# Altium project Acoustics Board.PrjPcb
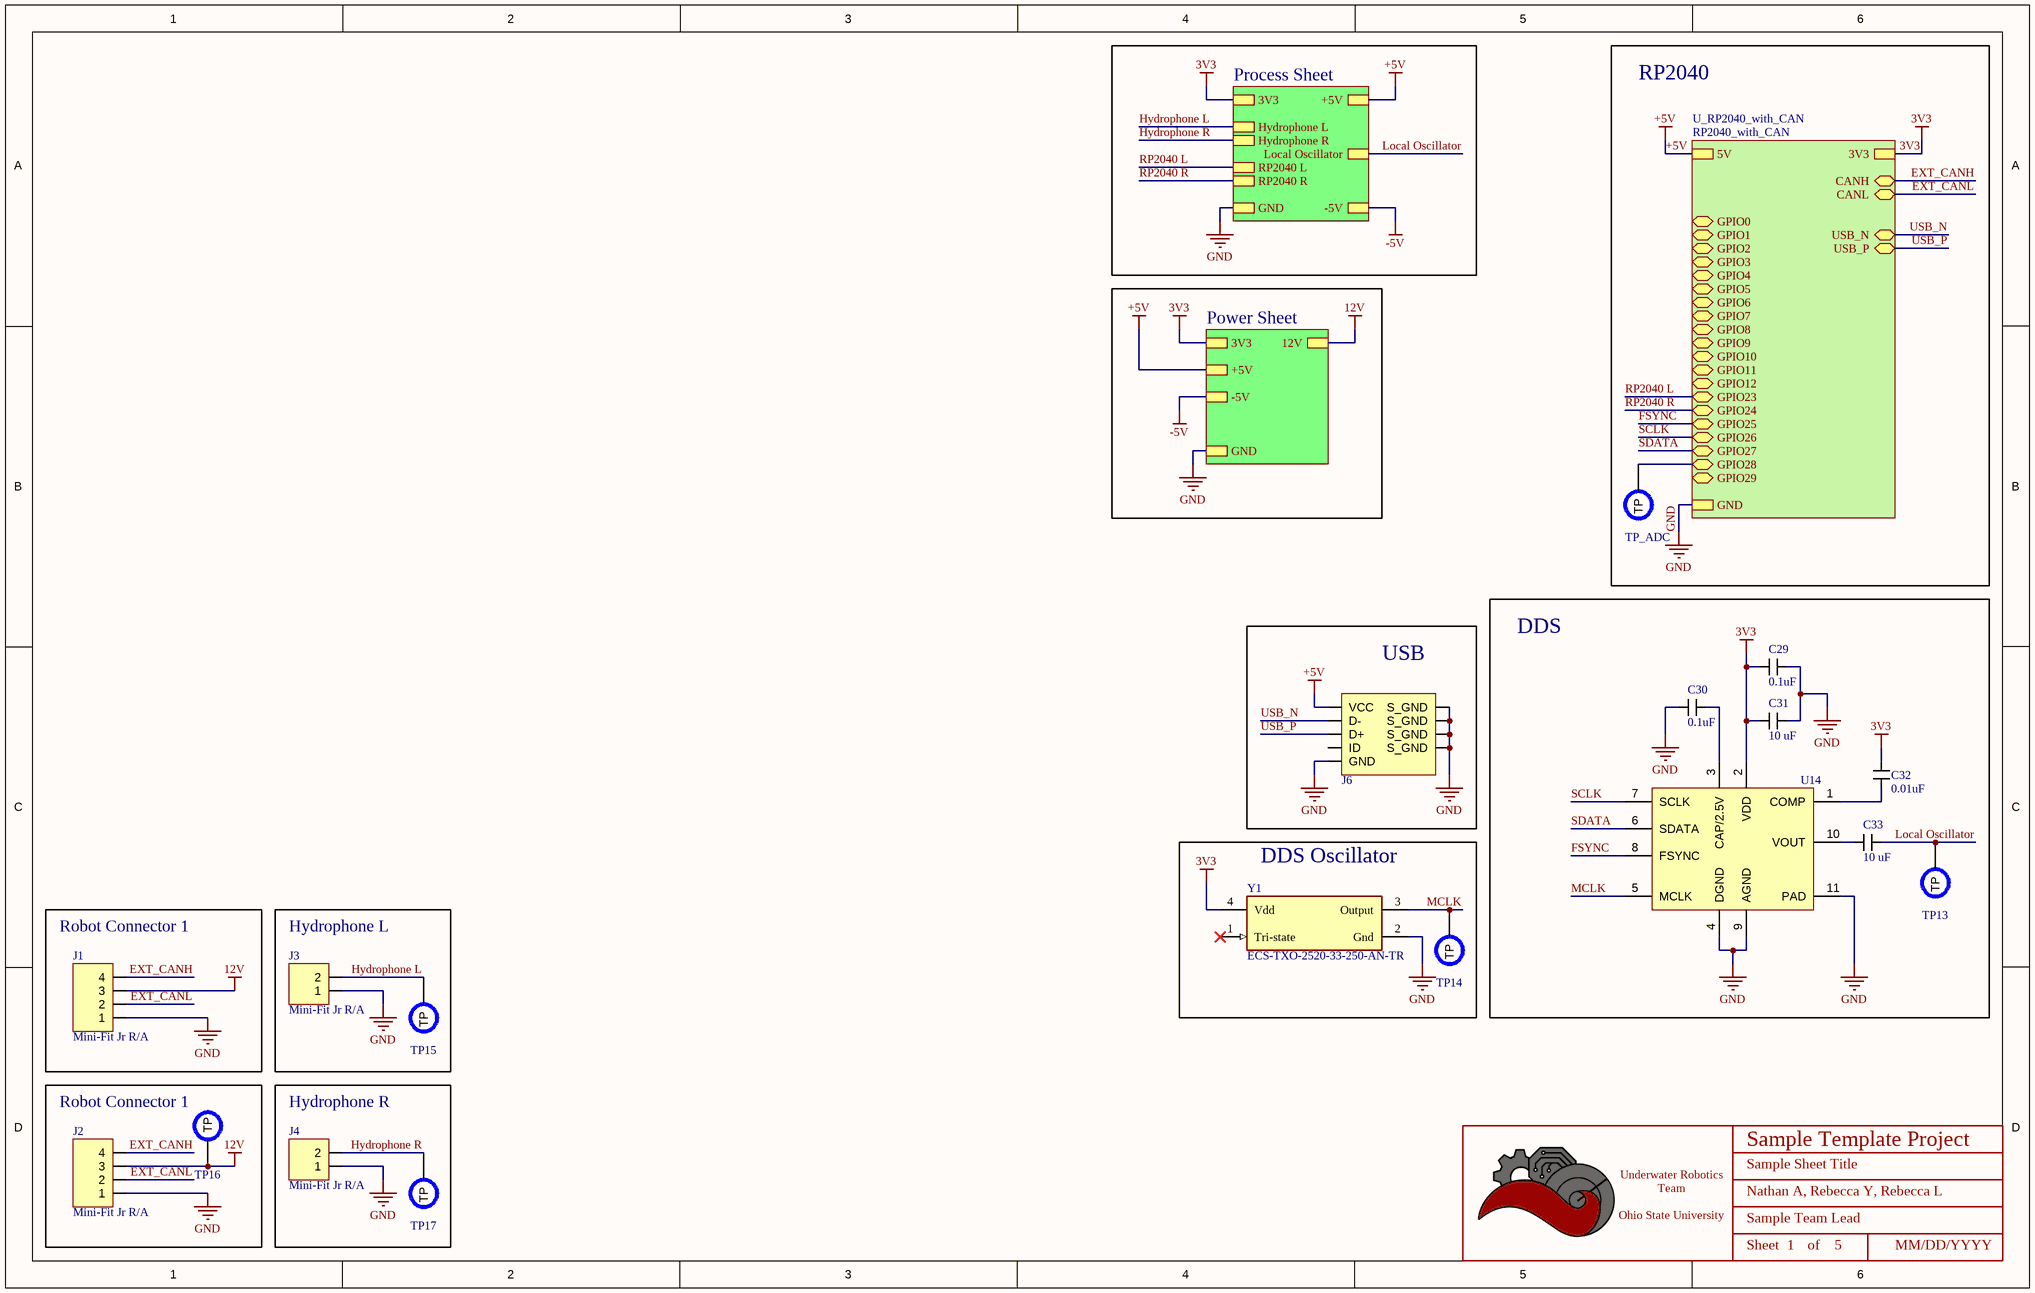
[diagram p0: [Acoustics] Connections & RP2040.SchDoc]
BoardRevision: 1.0; DateOfDesignReview: XX/XX/XXXX; ProjectTitle: Sample Template Project; TeamLead: Sample Team Lead
3 sheets, 72 parts. Net scope: strictly hierarchical (ports join the sheet entries above them; power ports are local).
Board file: Acoustics Board.PcbDoc
Sheets:
  [Acoustics] Connections & RP2040.SchDoc
    Process Sheet = [Acoustics] Hydrophone Process.SchDoc
    Power Sheet = [Acoustics] Power.SchDoc

## Sheet [Acoustics] Connections & RP2040.SchDoc: Sample Sheet Title
size B; Date: MM/DD/YYYY; Author: Nathan A, Rebecca Y, Rebecca L; Organization: ORGANIZATION; Address1: ADDRESS 1; Address2: ADDRESS 2; Address3: ADDRESS 3; Address4: ADDRESS 4; Revision: -; SheetNumber: 1; SheetTotal: 5; ENG_APP_DATE: --/--/--; DSN_APP_DATE: --/--/--; CHK_APP_DATE: --/--/--

### Parts
(Parts that share a designator on the sheet are numbered #1, #2 ... from top to bottom, then left to right.)
*#1  Title_Block  [LOGO]  (value not drawn)  (graphical)
C29  value 0.1uF  [CAPACITOR_0603]  (hidden comment: 100nF Ceramic 6.3V)
C30  value 0.1uF  [CAPACITOR_0603]  (hidden comment: 100nF Ceramic 6.3V)
C31  Value (uF): 10 uF  [CAPACITOR_0603]  (hidden comment: 10uF Ceramic 6.3V)
C32  value 0.01uF  [CAPACITOR_0603]  (hidden comment: CL10B103KB8NNNC)
C33  Value (uF): 10 uF  [CAPACITOR_0603]  (hidden comment: 10uF Ceramic 6.3V)
J1  Mini-Fit Jr R/A  [CONN_MOLEX_MINIFIT JR_4 POS_R/A]
J2  Mini-Fit Jr R/A  [CONN_MOLEX_MINIFIT JR_4 POS_R/A]
J3  Mini-Fit Jr R/A  [CONN_MOLEX_MINIFIT JR_2 POS_R/A]
J4  Mini-Fit Jr R/A  [CONN_MOLEX_MINIFIT JR_2 POS_R/A]
J6  USB_MICRO R/A  [CONN_MINIUSB]  (value not drawn)
TP13  PCB Test Point  [TESTPOINT_1.2MM]  (value not drawn)  (no BOM)
TP14  PCB Test Point  [TESTPOINT_1.2MM]  (value not drawn)  (no BOM)
TP15  PCB Test Point  [TESTPOINT_1.2MM]  (value not drawn)  (no BOM)
TP16  PCB Test Point  [TESTPOINT_1.2MM]  (value not drawn)  (no BOM)
TP17  PCB Test Point  [TESTPOINT_1.2MM]  (value not drawn)  (no BOM)
TP_ADC  PCB Test Point  [TESTPOINT_1.2MM]  (value not drawn)  (no BOM)
U14  IC DDS 5MHZ 10BIT 10LFCSP  [CP-10-9]  (value not drawn)
Y1  ECS-TXO-2520-33-250-AN-TR  [FP-ECS-TXO-2520-MFG]

### Blocks framed on the sheet
RP2040: TP_ADC
DDS: C29-C33 TP13 U14
USB: J6
DDS Oscillator: TP14 Y1
Robot Connector 1: J1
Hydrophone L: J3 TP15
Robot Connector 1: J2 TP16
Hydrophone R: J4 TP17

### Sub-sheets
Power Sheet = [Acoustics] Power.SchDoc: 3V3, 12V, -5V, GND, +5V
Process Sheet = [Acoustics] Hydrophone Process.SchDoc: Hydrophone L, Hydrophone R, RP2040 L, RP2040 R, 3V3, +5V, -5V, GND, Local Oscillator
U_RP2040_with_CAN = RP2040_with_CAN (file not in this document): USB_P (bidir), USB_N (bidir), 5V, CANH (bidir), CANL (bidir), GPIO0 (bidir), GPIO1 (bidir), GPIO2 (bidir), GPIO3 (bidir), GPIO4 (bidir), GPIO5 (bidir), GPIO6 (bidir), GPIO7 (bidir), GPIO8 (bidir), GPIO9 (bidir), GPIO10 (bidir), GPIO11 (bidir), GPIO12 (bidir), GPIO23 (bidir), GPIO24 (bidir), GPIO25 (bidir), GPIO26 (bidir), GPIO27 (bidir), GPIO28 (bidir), GPIO29 (bidir), 3V3, GND

### Nets
3V3: C29.2 C31.1 C32.1 U14.2(VDD) Y1.4(Vdd) ; sheet U_RP2040_with_CAN/3V3, sheet Process Sheet/3V3, sheet Power Sheet/3V3
12V: J1.3 J2.3 TP16.TP ; sheet Power Sheet/12V
+5V: J6.1(VCC) ; sheet U_RP2040_with_CAN/5V, sheet Process Sheet/+5V, sheet Power Sheet/+5V
-5V: sheet Process Sheet/-5V, sheet Power Sheet/-5V
GND: C29.1 C30.1 C31.2 J1.1 J2.1 J3.1 J4.1 J6.5(GND) J6.6(S_GND) J6.7(S_GND) J6.8(S_GND) J6.9(S_GND) U14.4(DGND) U14.9(AGND) U14.11(PAD) Y1.2(Gnd) ; sheet U_RP2040_with_CAN/GND, sheet Process Sheet/GND, sheet Power Sheet/GND
EXT_CANH: J1.4 J2.4 ; sheet U_RP2040_with_CAN/CANH
EXT_CANL: J1.2 J2.2 ; sheet U_RP2040_with_CAN/CANL
FSYNC: U14.8(FSYNC) ; sheet U_RP2040_with_CAN/GPIO25
Hydrophone L: J3.2 TP15.TP ; sheet Process Sheet/Hydrophone L
Hydrophone R: J4.2 TP17.TP ; sheet Process Sheet/Hydrophone R
Local Oscillator: C33.2 TP13.TP ; sheet Process Sheet/Local Oscillator
MCLK: TP14.TP U14.5(MCLK) Y1.3(Output)
RP2040 L: sheet U_RP2040_with_CAN/GPIO23, sheet Process Sheet/RP2040 L
RP2040 R: sheet U_RP2040_with_CAN/GPIO24, sheet Process Sheet/RP2040 R
SCLK: U14.7(SCLK) ; sheet U_RP2040_with_CAN/GPIO26
SDATA: U14.6(SDATA) ; sheet U_RP2040_with_CAN/GPIO27
USB_N: J6.2(D-) ; sheet U_RP2040_with_CAN/USB_N
USB_P: J6.3(D+) ; sheet U_RP2040_with_CAN/USB_P
NetC30_2: C30.2 U14.3(CAP/2.5V)
NetC32_2: C32.2 U14.1(COMP)
NetC33_1: C33.1 U14.10(VOUT)
NetTP_ADC_TP: TP_ADC.TP ; sheet U_RP2040_with_CAN/GPIO28

Not connected (* = marked no-connect by the designer): J6 4(ID); Y1 1(Tri-state)*

### Notes on the sheet
- DWG. NO.
- REV.
- SHT.
- THIS DOCUMENT AND THE DATA DISCLOSED HEREIN OR HEREWITH IS THE PROPERTY OF ALTIUM LIMITED AND MAY BE FREELY DISTRIBUTED IN WHOLE. NO RIGHTS ARE RESERVED OR EXPRESS OR IMPLIED WARANTEE GIVEN.
- REVISION
- DESCRIPTION
- DATE
- APPROVED
- ENG:
- APPROVALS
- PROJECT
- DSN:
- CHK:
- REFERENCE DOCUMENTS
- PROJECT REVISION:
- TITLE
- DOCUMENT REVISION:
- DESIGN ITEM:
- BOM:
- FAB DWG:
- PCB DWG:
- ASSY DWG:
- SCALE:
- SIZE
- B
- CAGE CODE
- FILE NAME
- DWG NO.
- SHEET
- OF
- REV
- (in symbol Title_Block) Underwater Robotics Team / Ohio State University; Sheet; of

### Library data of the parts
*#1 = Title_Block: UWRT Schematic Title Block Template / Created June 2021, Dylan Trainor
C29 C30 = CAPACITOR_0.1uF_0603: Cap 100nF 6.3V +/-10% / Ceramic 0603; Made By: Flip B; ComponentLink1Description: Datsheet; ComponentLink1URL: https://www.mouser.com/datasheet/2/212/KEM_C1002_X7R_SMD-1102033.pdf; Tolerance: +/- 10%; Voltage: 6.3V; Supplier 1: Digi-Key; Supplier Part Number 1: 399-15351-1-ND
C31 C33 = CAPACITOR_10uF_0603: Cap 10uF 6.3V +/-20% / Ceramic 0603; Made By: Flip B; ComponentLink1Description: Digikey; ComponentLink1URL: https://www.digikey.com/en/products/detail/samsung-electro-mechanics/CL10A106MQ8NNNC/3886777; Supplier 1: Digi-Key; Supplier Part Number 1: 1276-1119-1-ND; Tolerance: +/- 20%; Voltage: 6.3V
C32 = CAPACITOR_0.01uF_0603_50V: 10000 pF ±10% 50V Ceramic Capacitor X7R 0603 (1608 Metric); Tolerance: +/- 10%; Voltage: 6.3V; Made By: Flip B; ComponentLink1Description: Datsheet; ComponentLink1URL: https://www.mouser.com/datasheet/2/212/KEM_C1002_X7R_SMD-1102033.pdf; Supplier 1: Arrow Electronics; Supplier Part Number 1: CL10B103KB8NNNC
J1 J2 = CONN_MOLEX_MINIFIT JR_4POS_R/A: Molex Minifit Jr. 5569 / 4 Pos R/A Natural; Pitch: 4.2mm; Configuration: Right Angle; Current Per Pin: 13A; Number of Positions: 4; Supplier Part Number 1: WM13112-ND; Supplier 1: Digi-Key; Manufacturer: Molex; Color: Natural; Created By: Flip B; ComponentLink1Description: Datasheet; ComponentLink1URL: https://www.molex.com/pdm_docs/sd/026013115_sd.pdf; Series: Minifit Jr 5569
J3 J4 = CONN_MOLEX_MINIFIT JR_2POS_R/A: Molex Minifit Jr. 5569 / 2 Pos R/A Natural; Pitch: 4.2mm; Configuration: Right Angle; Current Per Pin: 13A; Number of Positions: 2; Manufacturer: Molex; Color: Natural; Created By: Robert P; ComponentLink1Description: Datasheet; ComponentLink1URL: https://www.molex.com/pdm_docs/sd/026013115_sd.pdf; Series: Minifit Jr 5569; Supplier 1: Digi-Key; Supplier Part Number 1: WM1351-ND
J6 = CONN_MICROUSB: Amphenol Micro USB-B / USB2.0 5 Pin Right Angle SMD; Pitch: 0.65mm; Current Per Pin: 1.8A; Number of Positions: 5; Manufacturer: Amphenol; Configuration: Right Angle; Color: Silver; Created By: Flip B; ComponentLink1Description: Datasheet; ComponentLink1URL: https://cdn.amphenol-icc.com/media/wysiwyg/files/documentation/datasheet/inputoutput/io_usb_micro.pdf?__cf_chl_jschl_tk__=05693735e19256298f6ef6ca2bb2e65c376a4f56-1625503833-0-Abitsb0-ufjOXJYs_S3J3r2iTn-nObalbmXUksF1VvO_h_WEmRdMlUD1I8-hmWSEVWzY1pirKnrPZWfgY3851qyBZe5ZvnNQePLGIzUgdEIQBVUyW36RsbYpDLEWxJ4horD-5gChFgobLYqwmG5aHl0E8lIn_twwPPrOxilK2gP0q9t_CNOs_u5fMqXvXUrlsOv8tIE2NRlu6NVP8qtkL2GjhlkeTUbDMF8WvvpPDTFOgvZ4Y16Ej8F8AhWos88mo5B1HssXozw0XrkJQIqERITUu6rqloz9kf4ZzhBHtDAt-IkiAFY_Ds9SW8FYKKTtINJVpHZQ6Gyu1FFM4Dc9MO0maE8_mmNcwlxqyRoRk_MPWW8VyByXWM5RSp52jteRKw7FeI9WIYvCbPAOy0Eyib-aseIQsnGbglBcUY6_2xp8GYaJM38H3dNvBPsSOfJBPndKedwKHllxjkucXn6xsN0sDXkpGN-cu8_2bDTJ0g-uUucKSCooYX-ApSDNGpkA_p9zv1SOAD8c0zaZVmtiBsN75QpVz2rzq9_BFxOywPvR; Series: 10118192; Supplier 1: Digi-Key; Supplier Part Number 1: 609-4613-1-ND
TP13-TP17 TP_ADC = TESTPOINT: Made By: Robert Pafford
U14 = AD9837ACPZ: Direct Digital Synthesis IC 10 b 5 MHz 28 b Tuning 10-LFCSP-WD (3x3)
Y1 = CMP-40224-000034-1: XTAL OSC TCXO 25.0000MHZ HCMOS; RoHS Compliant: Yes

## Sheet [Acoustics] Hydrophone Process.SchDoc: Sample Sheet Title
size B; Date: 10/22/2023; Author: Nathan A, Rebecca Y, Rebecca L; Organization: ORGANIZATION; Address1: ADDRESS 1; Address2: ADDRESS 2; Address3: ADDRESS 3; Address4: ADDRESS 4; Revision: -; SheetNumber: 2; SheetTotal: 5; ENG_APP_DATE: --/--/--; DSN_APP_DATE: --/--/--; CHK_APP_DATE: --/--/--
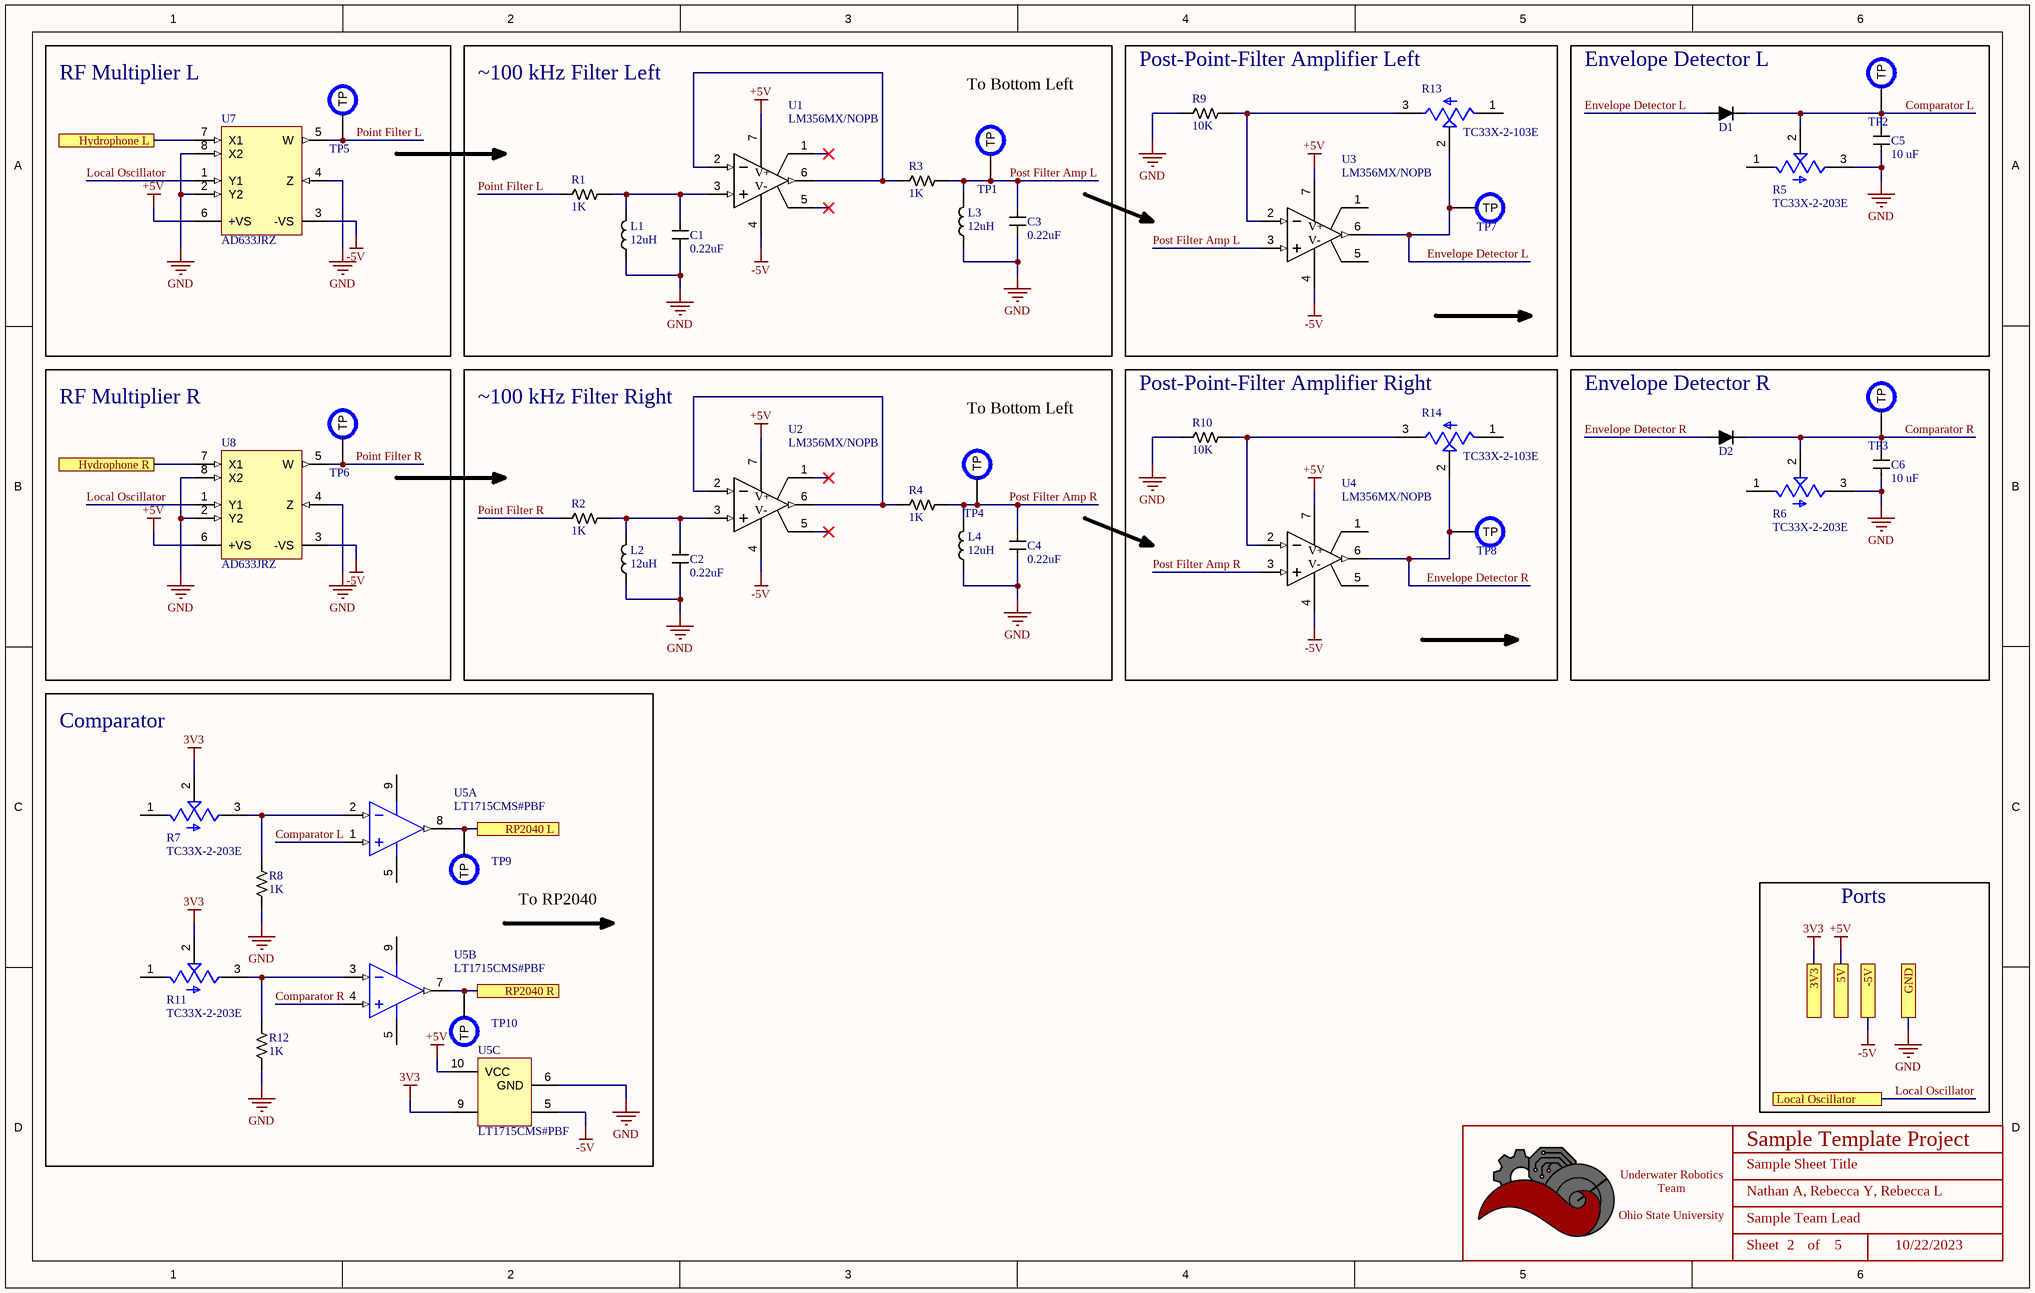
[diagram p1: [Acoustics] Hydrophone Process.SchDoc]

### Parts
(Parts that share a designator on the sheet are numbered #1, #2 ... from top to bottom, then left to right.)
*#2  Title_Block  [LOGO]  (value not drawn)  (graphical)
C1  value 0.22uF  [CAPACITOR_0603]  (hidden comment: 0.22uF Ceramic 16V)
C2  value 0.22uF  [CAPACITOR_0603]  (hidden comment: 0.22uF Ceramic 16V)
C3  value 0.22uF  [CAPACITOR_0603]  (hidden comment: 0.22uF Ceramic 16V)
C4  value 0.22uF  [CAPACITOR_0603]  (hidden comment: 0.22uF Ceramic 16V)
C5  Value (uF): 10 uF  [CAPACITOR_0603]  (hidden comment: 10uF Ceramic 6.3V)
C6  Value (uF): 10 uF  [CAPACITOR_0603]  (hidden comment: 10uF Ceramic 6.3V)
D1  BAR9002ELE6327XTMA1  [DIODE_0402]  (value not drawn)
D2  BAR9002ELE6327XTMA1  [DIODE_0402]  (value not drawn)
L1  value 12uH  [INDUCTOR_0603]  (hidden comment: FIXED IND 12UH 10MA 1.8 OHM SMD)
L2  value 12uH  [INDUCTOR_0603]  (hidden comment: FIXED IND 12UH 10MA 1.8 OHM SMD)
L3  value 12uH  [INDUCTOR_0603]  (hidden comment: FIXED IND 12UH 10MA 1.8 OHM SMD)
L4  value 12uH  [INDUCTOR_0603]  (hidden comment: FIXED IND 12UH 10MA 1.8 OHM SMD)
R1  Value  (Ohms): 1K  [RESISTOR_0603]  (hidden comment: 1.45k Ohm 0.1% 1/10W)
R2  Value  (Ohms): 1K  [RESISTOR_0603]  (hidden comment: 1.45k Ohm 0.1% 1/10W)
R3  Value  (Ohms): 1K  [RESISTOR_0603]  (hidden comment: 1.45k Ohm 0.1% 1/10W)
R4  Value  (Ohms): 1K  [RESISTOR_0603]  (hidden comment: 1.45k Ohm 0.1% 1/10W)
R5  TC33X-2-203E  [TRIM_TC33X-2-203E]
R6  TC33X-2-203E  [TRIM_TC33X-2-203E]
R7  TC33X-2-203E  [TRIM_TC33X-2-203E]
R8  Value  (Ohms): 1K  [RESISTOR_0402]  (hidden comment: 1k Ohm 1% 1/16W)
R9  Value  (Ohms): 10K  [RESISTOR_0603]  (hidden comment: 10k Ohm 0.5% 1/10W)
R10  Value  (Ohms): 10K  [RESISTOR_0603]  (hidden comment: 10k Ohm 0.5% 1/10W)
R11  TC33X-2-203E  [TRIM_TC33X-2-203E]
R12  Value  (Ohms): 1K  [RESISTOR_0402]  (hidden comment: 1k Ohm 1% 1/16W)
R13  TC33X-2-103E  [TRIM_TC33X-2-203E]
R14  TC33X-2-103E  [TRIM_TC33X-2-203E]
TP1  PCB Test Point  [TESTPOINT_1.2MM]  (value not drawn)  (no BOM)
TP2  PCB Test Point  [TESTPOINT_1.2MM]  (value not drawn)  (no BOM)
TP3  PCB Test Point  [TESTPOINT_1.2MM]  (value not drawn)  (no BOM)
TP4  PCB Test Point  [TESTPOINT_1.2MM]  (value not drawn)  (no BOM)
TP5  PCB Test Point  [TESTPOINT_1.2MM]  (value not drawn)  (no BOM)
TP6  PCB Test Point  [TESTPOINT_1.2MM]  (value not drawn)  (no BOM)
TP7  PCB Test Point  [TESTPOINT_1.2MM]  (value not drawn)  (no BOM)
TP8  PCB Test Point  [TESTPOINT_1.2MM]  (value not drawn)  (no BOM)
TP9  PCB Test Point  [TESTPOINT_1.2MM]  (value not drawn)  (no BOM)
TP10  PCB Test Point  [TESTPOINT_1.2MM]  (value not drawn)  (no BOM)
U1  LM356MX/NOPB  [SOIC-8]
U2  LM356MX/NOPB  [SOIC-8]
U3  LM356MX/NOPB  [SOIC-8]
U4  LM356MX/NOPB  [SOIC-8]
U5  LT1715CMS#PBF  [LT-MS10_N]  (parts A,B,C of 3)
U7  AD633JRZ  [ADI-R-8_M]
U8  AD633JRZ  [ADI-R-8_M]

### Blocks framed on the sheet
RF Multiplier L: TP5 U7
~100 kHz Filter Left: C1 C3 L1 L3 R1 R3 TP1 U1
Post-Point-Filter Amplifier Left: R9 R13 TP7 U3
Envelope Detector L: C5 D1 R5 TP2
RF Multiplier R: TP6 U8
~100 kHz Filter Right: C2 C4 L2 L4 R2 R4 TP4 U2
Post-Point-Filter Amplifier Right: R10 R14 TP8 U4
Envelope Detector R: C6 D2 R6 TP3
Comparator: R7 R8 R11 R12 TP9 TP10 U5

### Ports
3V3, 5V, -5V, GND, Hydrophone L, Hydrophone R, Local Oscillator, RP2040 L, RP2040 R

### Nets
3V3: R7.2(W) R11.2(W) U5.9(+VS) ; port 3V3
+5V: U1.7(V+) U2.7(V+) U3.7(V+) U4.7(V+) U5.10(VCC) U7.6(+VS) U8.6(+VS) ; port 5V
-5V: U1.4(V-) U2.4(V-) U3.4(V-) U4.4(V-) U5.5(VEE) U7.3(-VS) U8.3(-VS) ; port -5V
GND: C1.2 C2.2 C3.2 C4.2 C5.2 C6.2 L1.2 L2.2 L3.2 L4.2 R5.3(CW) R6.3(CW) R8.2 R9.2 R10.2 R12.2 U5.6(GND) U7.2(Y2) U7.4(Z) U7.8(X2) U8.2(Y2) U8.4(Z) U8.8(X2) ; port GND
Comparator L: C5.1 D1.2 R5.2(W) TP2.TP U5.1(+IN_A)
Comparator R: C6.1 D2.2 R6.2(W) TP3.TP U5.4(+IN_B)
Envelope Detector L: D1.1 R13.2(W) TP7.TP U3.6(OUT)
Envelope Detector R: D2.1 R14.2(W) TP8.TP U4.6(OUT)
Hydrophone L: U7.7(X1) ; port Hydrophone L
Hydrophone R: U8.7(X1) ; port Hydrophone R
Local Oscillator: U7.1(Y1) U8.1(Y1) ; port Local Oscillator
Point Filter L: R1.2 TP5.TP U7.5(W)
Point Filter R: R2.2 TP6.TP U8.5(W)
Post Filter Amp L: C3.1 L3.1 R3.1 TP1.TP U3.3(IN+)
Post Filter Amp R: C4.1 L4.1 R4.1 TP4.TP U4.3(IN+)
RP2040 L: TP9.TP U5.8(OUT_A) ; port RP2040 L
RP2040 R: TP10.TP U5.7(OUT_B) ; port RP2040 R
NetC1_1: C1.1 L1.1 R1.1 U1.3(IN+)
NetC2_1: C2.1 L2.1 R2.1 U2.3(IN+)
NetR3_2: R3.2 U1.2(IN-) U1.6(OUT)
NetR4_2: R4.2 U2.2(IN-) U2.6(OUT)
NetR7_3: R7.3(CW) R8.1 U5.2(-IN_A)
NetR9_1: R9.1 R13.3(CW) U3.2(IN-)
NetR10_1: R10.1 R14.3(CW) U4.2(IN-)
NetR11_3: R11.3(CW) R12.1 U5.3(-IN_B)

Not connected (* = marked no-connect by the designer): R5 1(CCW); R6 1(CCW); R7 1(CCW); R11 1(CCW); R13 1(CCW); R14 1(CCW); U1 1(Balance)* 5(Balance)*; U2 1(Balance)* 5(Balance)*; U3 1(Balance) 5(Balance); U4 1(Balance) 5(Balance)

### Notes on the sheet
- To Bottom Left
- To RP2040
- Ports
- DWG. NO.
- REV.
- SHT.
- THIS DOCUMENT AND THE DATA DISCLOSED HEREIN OR HEREWITH IS THE PROPERTY OF ALTIUM LIMITED AND MAY BE FREELY DISTRIBUTED IN WHOLE. NO RIGHTS ARE RESERVED OR EXPRESS OR IMPLIED WARANTEE GIVEN.
- REVISION
- DESCRIPTION
- DATE
- APPROVED
- ENG:
- APPROVALS
- PROJECT
- DSN:
- CHK:
- REFERENCE DOCUMENTS
- PROJECT REVISION:
- TITLE
- DOCUMENT REVISION:
- DESIGN ITEM:
- BOM:
- FAB DWG:
- PCB DWG:
- ASSY DWG:
- SCALE:
- SIZE
- B
- CAGE CODE
- FILE NAME
- DWG NO.
- SHEET
- OF
- REV
- (in symbol Title_Block) Underwater Robotics Team / Ohio State University; Sheet; of

### Library data of the parts
*#2 = Title_Block: as *#1 on sheet [Acoustics] Connections & RP2040
C1-C4 = CAPACITOR_0.000027uF_0603: CAP CER 0.22uF 16V X7R 0603; Tolerance: +/- 5%; Made By: Nathan Ayer; Voltage: 16V; ComponentLink2Description: Digikey; ComponentLink2URL: https://www.digikey.com/en/products/detail/yageo/CC0603JRX7R7BB224/5883645
C5 C6 = CAPACITOR_10uF_0603: as C31 on sheet [Acoustics] Connections & RP2040; ComponentLink1Description: Digikey; ComponentLink1URL: https://www.digikey.com/en/products/detail/samsung-electro-mechanics/CL10A106MQ8NNNC/3886777; Supplier 1: Digi-Key; Supplier Part Number 1: 1276-1119-1-ND; Tolerance: +/- 20%; Voltage: 6.3V
D1 D2 = RF Diode 80V 100mA: RF Diode PIN - Single 80V 100 mA 250 mW PG-TSLP-2-19; Forward Current: 100mA; Voltage - Peak Reverse: 80V; Package: 0402
L1-L4 = INDUCTOR_12uH_0603: 12 µH Shielded Multilayer Inductor 10 mA 1.8Ohm Max 0603 (1608 Metric); Tolerance: +/- 5%; Made By: Nathan Ayer; DC Resistance: 1.8Ohm; Current Rating: 10mA; ComponentLink1Description: Digikey; ComponentLink1URL: https://www.digikey.com/en/products/detail/tdk-corporation/MLF1608E120JTD25/4743066
R1-R4 = RESISTOR_1K_0603: RES 1.45K OHM 0.1% 1/10W 0603; Tolerance: +/- 0.1%; Made By: Nathan Ayer; ComponentLink1Description: Digikey; ComponentLink1URL: https://www.digikey.com/en/products/detail/koa-speer-electronics-inc/RN73H1JTTD1451B50/10688964; Wattage: 1/10W; Supplier: Digikey; Digikey Part Numer: CR0603-JW-104ELFTR-ND
R5-R7 R11 R13 R14 = TC33X-2-203E: 20 kOhms 0.1W, 1/10W J Lead Surface Mount Trimmer Potentiometer Cermet 1 Turn Top Adjustment; MF: Bourns; Value: *; SnapEDA_Link: https://www.snapeda.com/parts/TC33X-2-203E/Bourns/view-part/312812/?ref=snap; Check_prices: https://www.snapeda.com/parts/TC33X-2-203E/Bourns/view-part/312812/?ref=eda; Digi-Key_Part_Number: TC33X-2-203ECT-ND; Purchase-URL: https://pricing.snapeda.com/search/part/TC33X-2-203E/?ref=eda; Package: 1608 Bourns; MP: TC33X-2-203E
  R7 R11: Supplier 1: Mouser; Supplier Part Number 1: 652-TC33X-2-203E
R8 R12 = RESISTOR_1K_0402: RES 1k OHM 1% 1/16W 0402; Tolerance: +/- 1%; Made By: Robert Pafford; Wattage: 1/16W; Supplier: Digikey; Digikey Part Numer: CR0603-JW-104ELFTR-ND; Supplier 1: Digi-Key; Supplier Part Number 1: 13-AC0402FR-131KLCT-ND
R9 R10 = RESISTOR_10K_0.5%_0603: RES 10k OHM 0.5% 1/10W 0603; Tolerance: +/- 0.5%; Made By: Robert Pafford; Wattage: 1/10W; Supplier: Digikey; Digikey Part Numer: CR0603-JW-104ELFTR-ND; Supplier 1: Digi-Key; Supplier Part Number 1: 749-1695-1-ND
TP1-TP10 = TESTPOINT: Made By: Robert Pafford
U1-U4 = LM356MX/NOPB: IC OPAMP JFET 1 CIRCUIT 8SOIC; PartNumber: LM8261M5X/NOPB; Manufacturer: Texas Instruments; Supply Current: 1.3 mA; Supply Voltage: 2.5 V ~ 30 V, +/- 1.25 V ~ 15 V; Gain Bandwidth Product: 21 MHz; Created By: Dylan T; ComponentLink1Description: Digi-Key; ComponentLink1URL: https://www.digikey.com/en/products/detail/texas-instruments/LF356MX-NOPB/366701
U5 = CMP-0360-00164-2: 4 ns, 150 MHz Comparator with Independent Input / Output Supplies, 2 Channels, 2.7 to 12 V, 0 to +70 degC, 10-pin MSOP (MS10); Generic Part Number: LT1715; Manufacturer: Linear Technology; Prop Delay (us): 0.004; Vos (mV) Typical: 0.4; Channels (#): 2; Vs Min (V): 2.7; Supply Current (uA) Typical: 7500; Vos (mV) Guaranteed: 2.5; Vs Max (V): 12; Supply Voltage Range: 2.7 to 12 V; ComponentLink1Description: Manufacturer URL; ComponentLink1URL: http://www.linear.com/; RoHS: Y; ComponentLink2URL: http://cds.linear.com/docs/en/datasheet/1715fa.pdf; Features: Comparator, Separate In/Out Power Supply; Mounting Technology: Surface Mount; ComponentLink3URL: http://cds.linear.com/docs/en/packaging/MSOP_10_05-08-1661.pdf; ComponentLink3Description: Package Specification; PartNumber: LT1715CMS#PBF; PackageReference: MS10; ComponentLink2Description: Datasheet; PackageDescription: 10-Pin MSOP, Body 3 x 3 mm, Pitch 0.5 mm; DatasheetVersion: Rev A
U7 U8 = CMP-1592-00007-1: Low Cost Analog Multiplier, 20 V/us, 6 mA, 0 to 70 degC, 8-Pin SOIC (R), RoHS, Tube; PartNumber: AD633; Supply Current Max: 6 mA; Slew Rate: 20 V/us; Number of Channels: 2; DatasheetVersion: Rev. K; PackageDescription: 8-Pin Small Outline Package, Body 4.9 x 3.9 mm, Pitch 1.27 mm; PackageVersion: 06/2006; ComponentLink3Description: Package Specification; ComponentLink2Description: Datasheet; RoHS: TRUE; Mounting Technology: Surface Mount; ComponentLink1Description: Manufacturer URL; Packing: Tube; Code_JEDEC: MS-012-AA; ComponentLink1URL: http://www.analog.com/en/index.html; Temperature Max: 70 degC; Temperature Min: 0 degC; ComponentLink3URL: http://www.analog.com/media/en/package-pcb-resources/package/pkg_pdf/soic_narrow-r/r_8.pdf; ComponentLink2URL: http://www.analog.com/media/en/technical-documentation/data-sheets/AD633.pdf

## Sheet [Acoustics] Power.SchDoc: Sample Sheet Title
size B; Date: MM/DD/YYYY; Author: Nathan A, Rebecca Y, Rebecca L; Organization: ORGANIZATION; Address1: ADDRESS 1; Address2: ADDRESS 2; Address3: ADDRESS 3; Address4: ADDRESS 4; Revision: -; SheetNumber: 3; SheetTotal: 5; ENG_APP_DATE: --/--/--; DSN_APP_DATE: --/--/--; CHK_APP_DATE: --/--/--
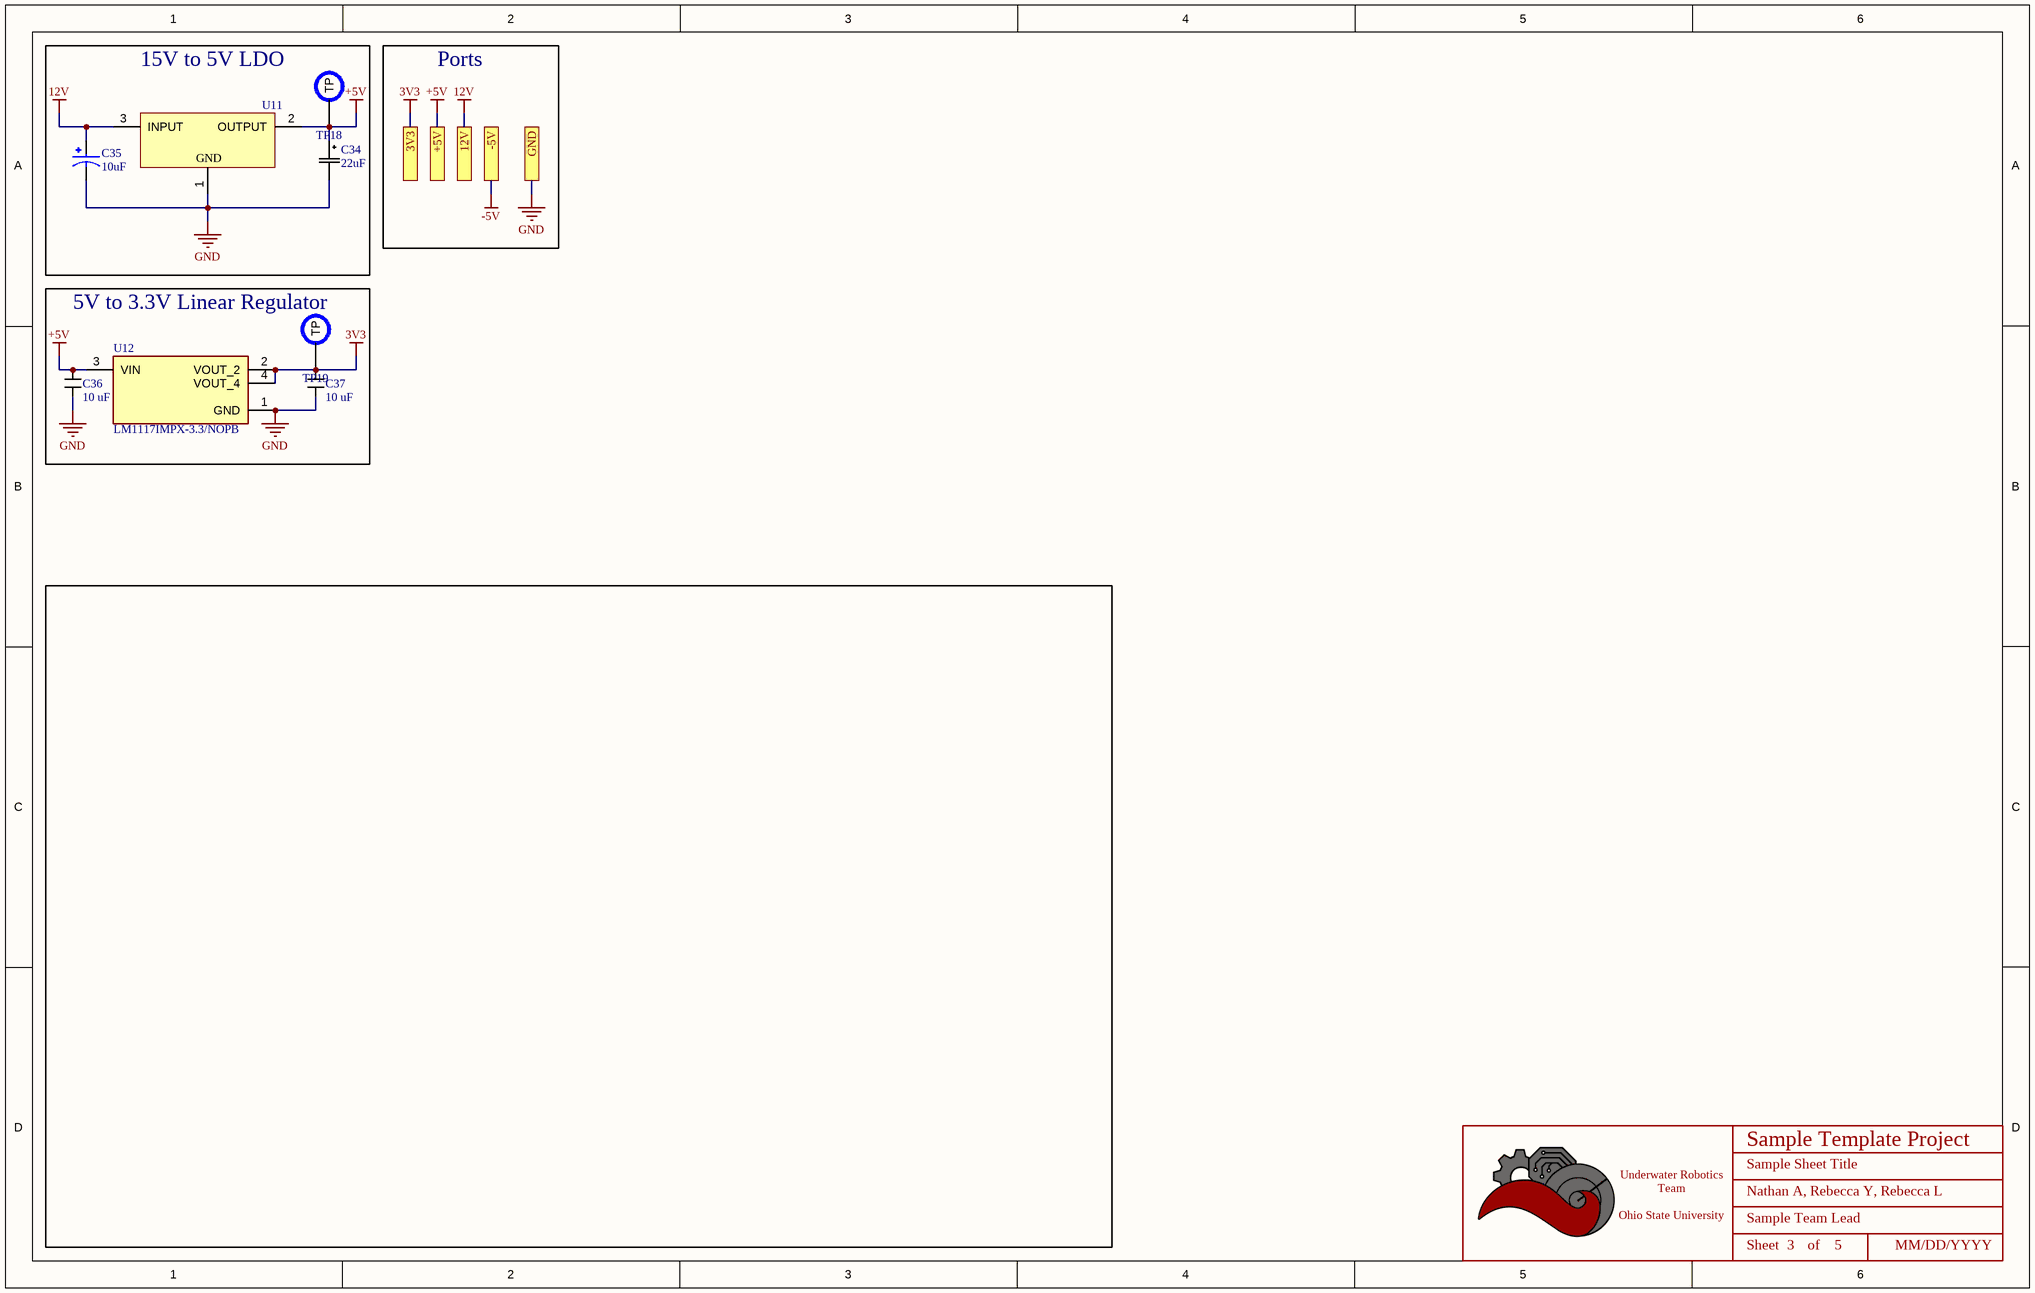
[diagram p2: [Acoustics] Power.SchDoc]

### Parts
(Parts that share a designator on the sheet are numbered #1, #2 ... from top to bottom, then left to right.)
*#3  Title_Block  [LOGO]  (value not drawn)  (graphical)
C34  value 22uF  [PCAP_8x5.4-ELECT_NCA]  (hidden comment: 22uF electrolytic 35 V)
C35  value 10uF  [CAP_EEHZC1J100P]  (hidden comment: 10uF electrolytic 63V)
C36  Value (uF): 10 uF  [CAPACITOR_0603]  (hidden comment: 10uF Ceramic 6.3V)
C37  Value (uF): 10 uF  [CAPACITOR_0603]  (hidden comment: 10uF Ceramic 6.3V)
TP18  PCB Test Point  [TESTPOINT_1.2MM]  (value not drawn)  (no BOM)
TP19  PCB Test Point  [TESTPOINT_1.2MM]  (value not drawn)  (no BOM)
U11  AZ1117IH-5.0TRG1  [SOT223-3]  (value not drawn)
U12  LM1117IMPX-3.3/NOPB  [SOT-223-4]

### Blocks framed on the sheet
15V to 5V LDO: C34 C35 TP18 U11
5V to 3.3V Linear Regulator: C36 C37 TP19 U12

### Ports
3V3, 12V, +5V, -5V, GND

### Nets
3V3: C37.1 TP19.TP U12.2(VOUT_2) U12.4(VOUT_4) ; port 3V3
12V: C35.1 U11.3(INPUT) ; port 12V
+5V: C34.1 C36.1 TP18.TP U11.2(OUTPUT) U12.3(VIN) ; port +5V
GND: C34.2 C35.2 C36.2 C37.2 U11.1(GND) U12.1(GND) ; port GND

### Notes on the sheet
- Ports
- DWG. NO.
- REV.
- SHT.
- THIS DOCUMENT AND THE DATA DISCLOSED HEREIN OR HEREWITH IS THE PROPERTY OF ALTIUM LIMITED AND MAY BE FREELY DISTRIBUTED IN WHOLE. NO RIGHTS ARE RESERVED OR EXPRESS OR IMPLIED WARANTEE GIVEN.
- REVISION
- DESCRIPTION
- DATE
- APPROVED
- ENG:
- APPROVALS
- PROJECT
- DSN:
- CHK:
- REFERENCE DOCUMENTS
- PROJECT REVISION:
- TITLE
- DOCUMENT REVISION:
- DESIGN ITEM:
- BOM:
- FAB DWG:
- PCB DWG:
- ASSY DWG:
- SCALE:
- SIZE
- B
- CAGE CODE
- FILE NAME
- DWG NO.
- SHEET
- OF
- REV
- (in symbol Title_Block) Underwater Robotics Team / Ohio State University; Sheet; of

### Library data of the parts
*#3 = Title_Block: as *#1 on sheet [Acoustics] Connections & RP2040
C34 = CAP ALUM 22UF 20% 35V SMD: 22 µF 35 V Aluminum Electrolytic Capacitors Radial, Can - SMD 1000 Hrs; Made by: Robert Pafford; Voltage: 35V; Supplier 1: Digi-Key; Supplier Part Number 1: PCE3952DKR-ND
C35 = CAP ALUM 10UF 20% 63V SMD: 10 µF 63 V Aluminum - Polymer Capacitors Radial, Can SMD 120mOhm; Made by: Robert Pafford; Tolerance: +/- 20%; Max Voltage: 63V; Supplier 1: Digi-Key; Supplier Part Number 1: P15466CT-ND
C36 C37 = CAPACITOR_10uF_0603: as C31 on sheet [Acoustics] Connections & RP2040; ComponentLink1Description: Digikey; ComponentLink1URL: https://www.digikey.com/en/products/detail/samsung-electro-mechanics/CL10A106MQ8NNNC/3886777; Supplier 1: Digi-Key; Supplier Part Number 1: 1276-1119-1-ND; Tolerance: +/- 20%; Voltage: 6.3V
TP18 TP19 = TESTPOINT: Made By: Robert Pafford
U11 = AZ1117IH-5.0TRG1: Linear Voltage Regulator IC Positive Fixed 1 Output 1A SOT-223-3
U12 = LM1117IMPX-3.3/NOPB: 800-mA 15-V linear voltage regulator 4-SOT-223 -40 to 125; MF: Texas Instruments; Texas_Instruments-Purchase-URL: https://snapeda.com/shop?store=Texas+Instruments&id=410186; Price: None; Mouser-Purchase-URL: https://snapeda.com/shop?store=Mouser&id=410186; MP: LM1117IMPX-3.3/NOPB; Value: *; Availability: Good; Package: SOT-223-4 Texas Instruments; Arrow_Electronics-Purchase-URL: https://snapeda.com/shop?store=Arrow+Electronics&id=410186; SnapEDA_Link: https://www.snapeda.com/parts/LM1117IMPX-3.3/NOPB/Texas%20Instruments/view-part/410186/?ref=snap; DigiKey-Purchase-URL: https://snapeda.com/shop?store=DigiKey&id=410186

## Nets that join several sheets
3V3: [Acoustics] Connections & RP2040 (5 pins), [Acoustics] Hydrophone Process (R7.2 R11.2 U5.9), [Acoustics] Power (C37.1 TP19.TP U12.2 U12.4)
12V: [Acoustics] Connections & RP2040 (J1.3 J2.3 TP16.TP), [Acoustics] Power (C35.1 U11.3)
+5V: [Acoustics] Connections & RP2040 (J6.1), [Acoustics] Power (5 pins)
GND: [Acoustics] Connections & RP2040 (16 pins), [Acoustics] Hydrophone Process (23 pins), [Acoustics] Power (6 pins)
Hydrophone L: [Acoustics] Connections & RP2040 (J3.2 TP15.TP), [Acoustics] Hydrophone Process (U7.7)
Hydrophone R: [Acoustics] Connections & RP2040 (J4.2 TP17.TP), [Acoustics] Hydrophone Process (U8.7)
Local Oscillator: [Acoustics] Connections & RP2040 (C33.2 TP13.TP), [Acoustics] Hydrophone Process (U7.1 U8.1)